# Altium schematic sheet Sensors.SchDoc
size A; DocumentNumber: 3; SheetNumber: 3; SheetTotal: 5
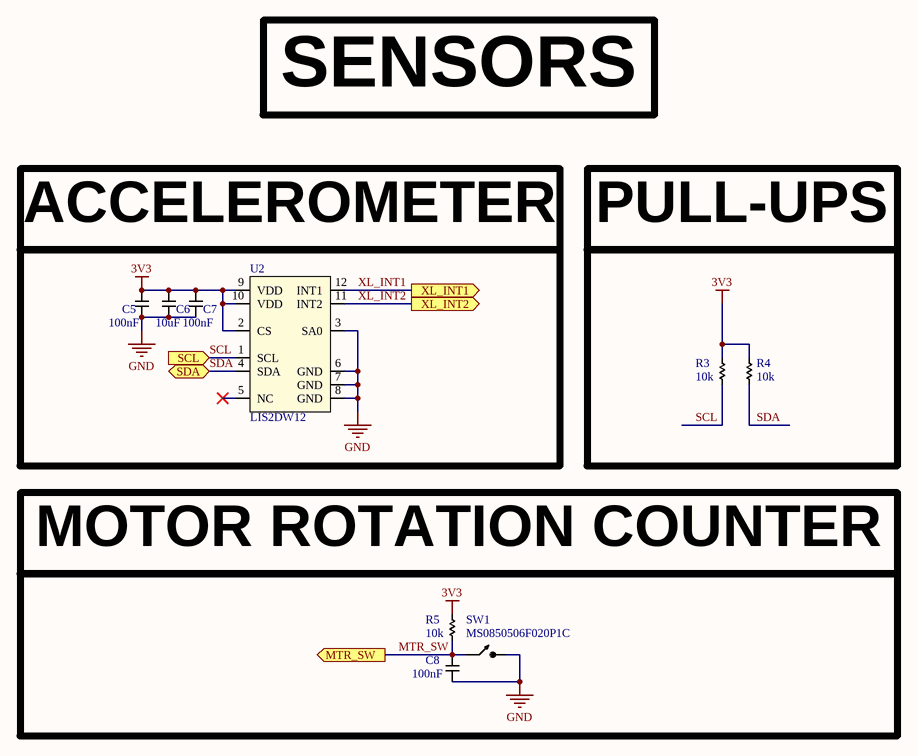
[diagram p0: Sensors.SchDoc]

## Parts
C5  100nF  [CAP_0402_HIGH]
C6  10uF  [CAP_0603_HIGH]
C7  100nF  [CAP_0402_HIGH]
C8  100nF  [CAP_0402_HIGH]
R3  10k  [RES_0402_HIGH]
R4  10k  [RES_0402_HIGH]
R5  10k  [RES_0402_HIGH]
SW1  MS0850506F020P1C  [MS0850506F020P1C]
U2  LIS2DW12  [LIS2DW12]

## Ports
MTR_SW (out), SCL (in), SDA, XL_INT1 (out), XL_INT2 (out)

## Nets
3V3: C5.2 C6.2 C7.2 R3.2 R4.2 R5.2 U2.2(CS) U2.9(VDD) U2.10(VDD)
GND: C5.1 C6.1 C7.1 C8.1 SW1.2 U2.3(SA0) U2.6(GND) U2.7(GND) U2.8(GND)
MTR_SW: C8.2 R5.1 SW1.1 ; port MTR_SW
SCL: R3.1 U2.1(SCL) ; port SCL
SDA: R4.1 U2.4(SDA) ; port SDA
XL_INT1: U2.12(INT1) ; port XL_INT1
XL_INT2: U2.11(INT2) ; port XL_INT2

Not connected (* = marked no-connect by the designer): U2 5(NC)*

## Notes on the sheet
- SENSORS
- ACCELEROMETER
- PULL-UPS
- (near R5) MOTOR ROTATION COUNTER

## Library data of the parts
C5 C7 C8 = Capacitor_0402: 0402 Capacitor
C6 = Capacitor_0603: 0603 Capacitor
R3-R5 = Resistor_0402: 0402 Resistor
SW1 = MS0850506F020P1C: MS0850506F020P1C SWITCH SNAP ACT SPST-NO 5A 125V
U2 = LIS2DW12: LIS2DW12 Accelerometer X, Y, Z Axis ±2g, 4g, 8g, 16g 400Hz 12-LGA (2x2)